# EAGLE design fp_bnc (EAGLE 9.6.2)
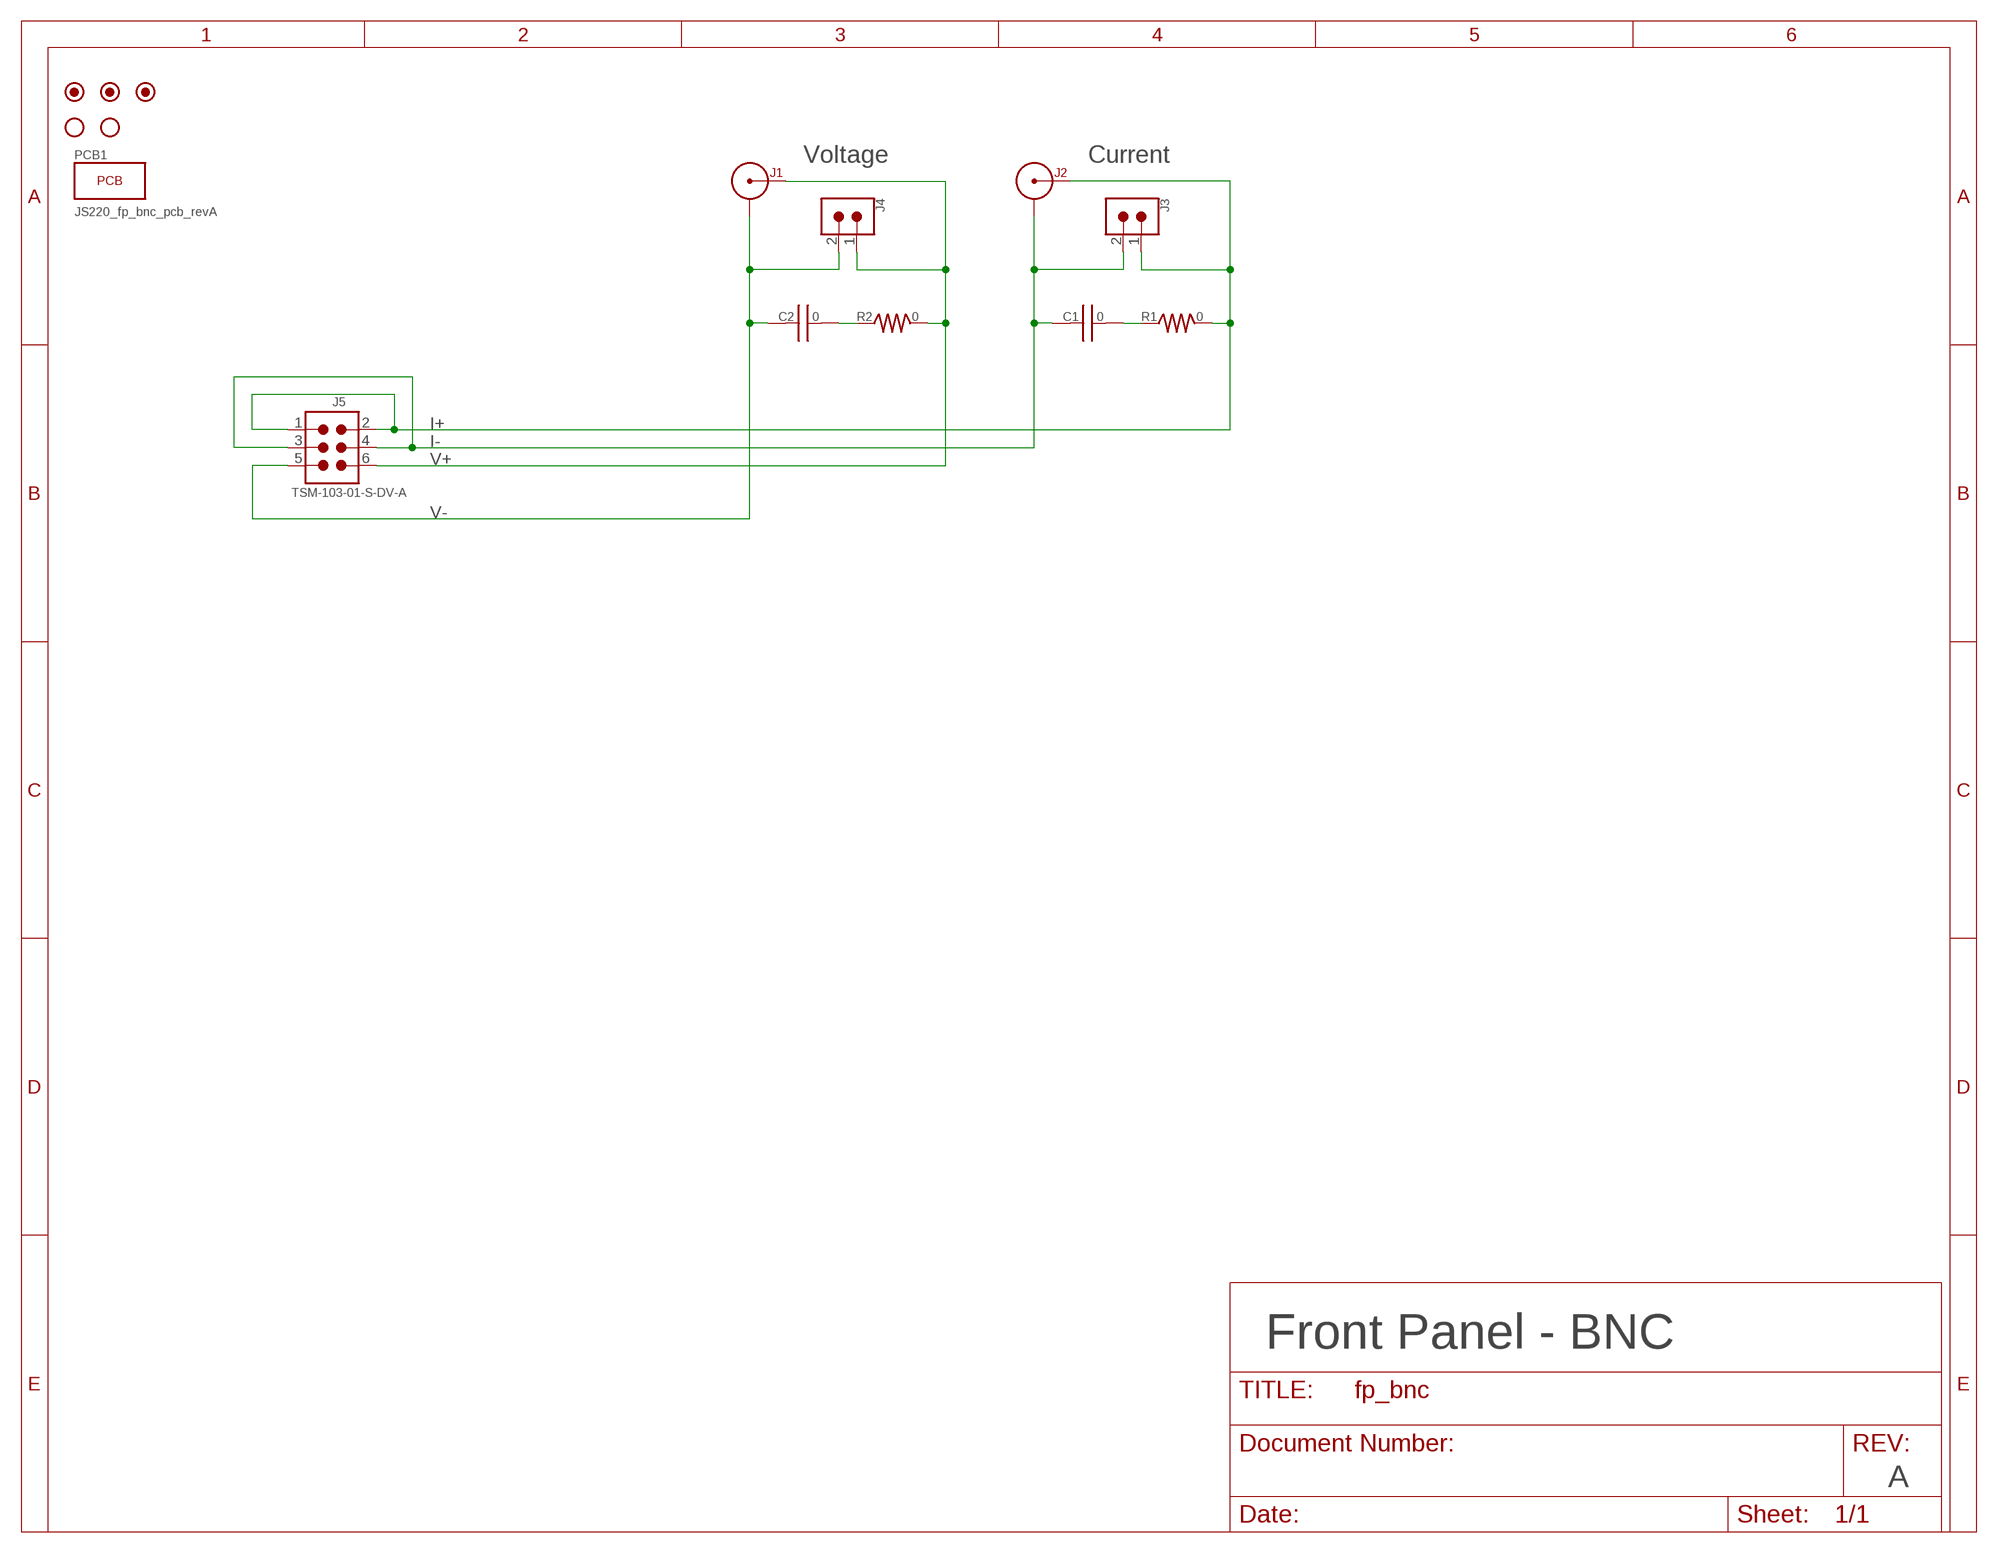
[diagram p0: schematic, sheet 1]
PCB1 (PCB): POPULATE: 1

## Parts
C1  0  CAP_0603  [0603]
C2  0  CAP_0603  [0603]
FUD1  FIDUCIAL_1MM  [FIDUCIAL_1MM_2MM]
FUD2  FIDUCIAL_1MM  [FIDUCIAL_1MM_2MM]
FUD3  FIDUCIAL_1MM  [FIDUCIAL_1MM_2MM]
H1  HOLE_#6_NORESTRICT  [HOLE_3.5MM_NORESTRICT]
H2  HOLE_#6_NORESTRICT  [HOLE_3.5MM_NORESTRICT]
J1  031-5329-52RFX  BNC_JACKBNC_31-5329-52RFX  [BNC_31-5329-52RFX]
J2  031-5329-52RFX  BNC_JACKBNC_31-5329-52RFX  [BNC_31-5329-52RFX]
J3  CONN_0.1_2X1  [CONN_0.1_2X1_M]
J4  CONN_0.1_2X1  [CONN_0.1_2X1_M]
J5  TSM-103-01-S-DV-A  CONN_0.1_3X2_MSA  [CONN_0.1_3X2_MSA]
R1  0  RESISTOR_1206  [1206]
R2  0  RESISTOR_1206  [1206]

## Nets
I+: J2.SIGNAL J3.1 J5.1 J5.2 R1.2
I-: C1.1 J2.G@1(SHIELD) J2.G@2(SHIELD) J2.G@3(SHIELD) J2.G@4(SHIELD) J3.2 J5.3 J5.4
I_T: C1.2 R1.1
V+: J1.SIGNAL J4.1 J5.6 R2.2
V-: C2.1 J1.G@1(SHIELD) J1.G@2(SHIELD) J1.G@3(SHIELD) J1.G@4(SHIELD) J4.2 J5.5
V_T: C2.2 R2.1

## Notes on the sheet
- Voltage | Current
- Front Panel - BNC
- A

## Library data of the parts
C1 C2 = jetperch:CAP; POPULATE: 0
FUD1-FUD3 = jetperch:FIDUCIAL; POPULATE: 0
H1 H2 = jetperch:HOLE; POPULATE: 0
J1 J2 = jetperch:BNC_JACK: BNC Jack (female) 31-5640-1010 is right angle, through hole 31-5329-52RFX is straight, through hole; MPN: 031-5329-52RFX; POPULATE: 1
J3 J4 = jetperch:CONN_0.1_2X1: 2x1 0.1" header; POPULATE: 0
J5 = jetperch:CONN_0.1_3X2; MPN: TSM-103-01-S-DV-A; POPULATE: 1
R1 R2 = jetperch:RESISTOR; POPULATE: 0; TOLERANCE: 1%

## Board
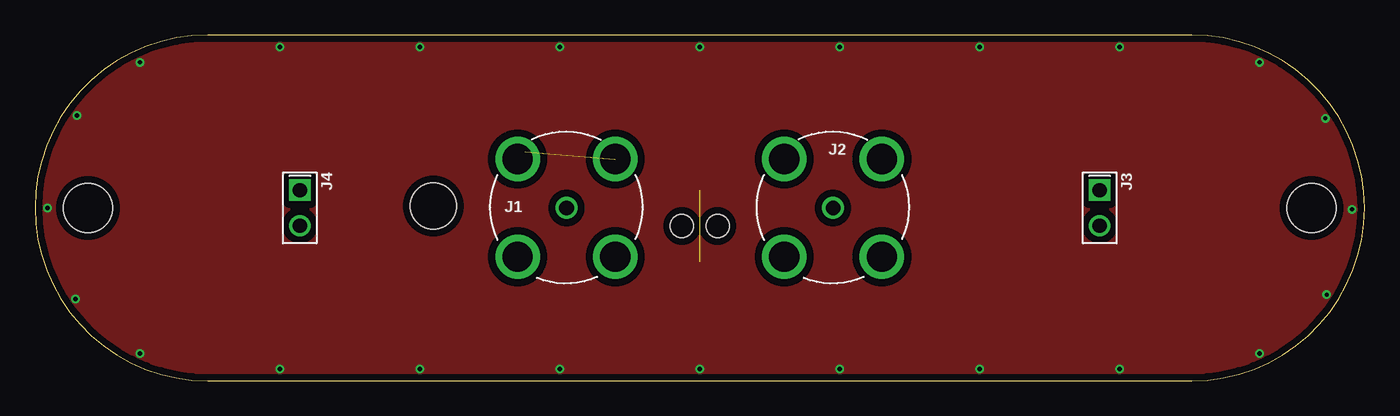
[diagram p1: board, top side]
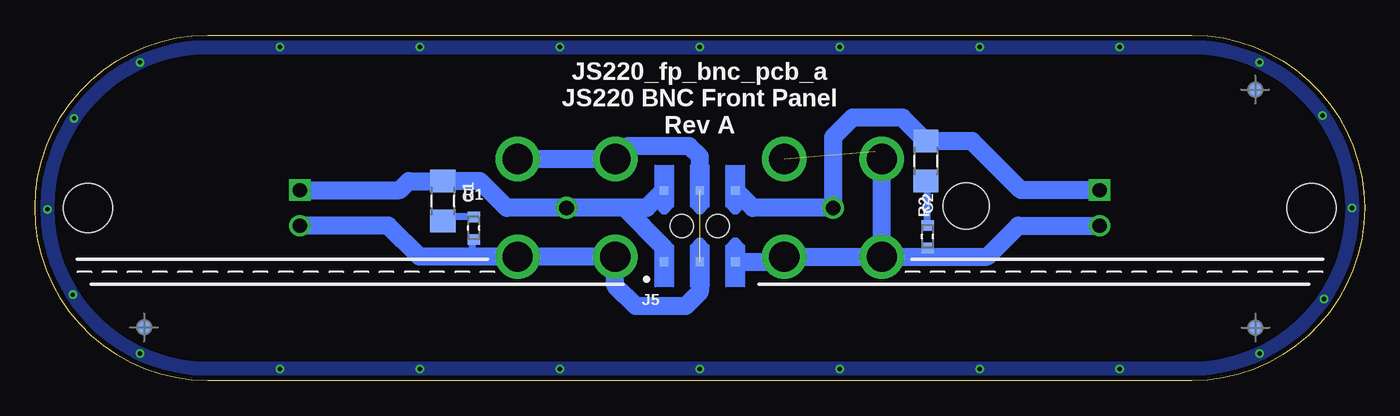
[diagram p2: board, bottom side, seen from below]

Size 95 x 24.7 mm. Coordinates in mm from the lower left corner, seen from the top.
Outline: 0,12.35 arc90 12.35,0 82.65,0 arc90 95,12.35 arc90 82.65,24.7 12.35,24.7 arc90 0,12.35
Copper layers (1*16): Top 0.035mm / dielectric 62mil / Bottom 0.035mm
Design rules "jetperch_2layer_oshpark": minimum track width 6mil, minimum drill 12mil, track to track 6mil, track to pad 6mil, pad to pad 6mil, via to via 6mil, smd to smd 0mil, copper to edge 15mil, drill to drill 15mil, minimum pad ring 6mil, minimum via ring 6mil, stop-mask expansion 2mil, vias tented up to drill 15mil, thermal gap 10mil
Holes 3.3 mm at 28.45,12.5

### Footprints (pad centres in the part's own frame; a part is rotated, then mirrored left to right if it is on the bottom)
0603 = smd 0.75 x 0.9: 1 -0.8,0; 2 0.8,0
FIDUCIAL_1MM_2MM = smd 1.016 x 1.016: P1 0,0
HOLE_3.5MM_NORESTRICT = hole 3.5: 0,0
BNC_31-5329-52RFX = drill 2.159: G@1 -3.489,3.489; G@2 3.489,3.489; G@3 3.489,-3.489; G@4 -3.489,-3.489 | drill 1.05: SIGNAL 0,0
CONN_0.1_2X1_M = drill 1.016 square: 1 -1.27,0 | drill 1.016: 2 1.27,0
CONN_0.1_3X2_MSA = smd 0.635 x 0.635: 1 -2.54,-2.54; 2 -2.54,2.54; 3 0,-2.54; 4 0,2.54; 5 2.54,-2.54; 6 2.54,2.54 | hole 1.651: -1.27,0; 1.27,0
1206 = smd 1.6 x 1.803: 1 -1.422,0; 2 1.422,0

### Placement (x,y rotation side)
C1  63.66,10.91 90 bottom
C2  31.22,10.3 90 bottom
FUD1  7.79,3.79 0 bottom
FUD2  7.81,20.79 0 bottom
FUD3  87.21,3.81 0 bottom
H1  3.79,12.35 0 top
H2  91.21,12.35 0 top
J1  37.98,12.35 0 top
J2  57.02,12.35 0 top
J3  76.08,12.35 270 top
J4  18.93,12.35 270 top
J5  47.5,11.06 0 bottom
R1  65.86,12.84 90 bottom
R2  31.34,15.7 90 bottom

### Tracks (layer width: path | path; a pad name or v marks a point on that pad's centre or on a via)
CGND  (via drill 0.3)
  other vias: 47.5,23.85 57.5,23.85 67.5,23.85 77.5,23.85 37.5,23.85 27.5,23.85 17.5,23.85 17.5,0.85 27.5,0.85 37.5,0.85 47.5,0.85 57.5,0.85 67.5,0.85 77.5,0.85 87.5,22.75 87.5,1.95 94.1,12.25 92.2,18.75 92.3,6.15 7.5,1.95 7.5,22.75 3,18.95 0.9,12.35 2.9,5.85
  pour Top (isolate 0.508): 12.35,24.7 82.65,24.7 arc-90 95,12.35 arc-90 82.65,0 12.35,0 arc-90 0,12.35 arc-90
  pour Bottom (isolate 0.254): 48,0 12.35,0 arc-90 0,12.35 arc-90 12.35,24.7 47.5,24.7 47.5,23.45 12.35,23.45 arc90 1.25,12.35 arc90 12.35,1.25 47.5,1.25
  pour Bottom (isolate 0.254): 47.5,0 47.5,1.25 82.65,1.25 arc90 93.75,12.35 arc90 82.65,23.45 47.5,23.45 47.5,24.7 82.65,24.7 arc-90 95,12.35 arc-90 82.65,0
I+
  Bottom 1.27: J5.1 50.04,9.5 52.89,12.35 | 52.89,12.35 J2.SIGNAL 61.3,12.35 63.21,14.26 R1.2 68.29,14.26 68.93,13.62 J3.1 | J5.2 51.29,12.35 52.89,12.35
I-  (1 unrouted)
  Bottom 0.508: 60.77,16.1 J2.G@2 | C1.1 63.75,10.01 63.75,8.86
  Bottom 1.27: J5.3 47.5,6.35 48.51,5.33 52.07,5.33 53.54,6.8 J2.G@4 J2.G@3 63.75,8.86 67.53,8.86 69.75,11.08 J3.2 | J5.4 47.5,16 48.26,16.76 52.61,16.76 J2.G@1 J2.G@2
I_T
  Bottom 0.508: C1.2 65.57,11.71 R1.1
V+
  Bottom 1.27: J5.6 43.71,12.35 J1.SIGNAL 37.98,17.4 36.58,18.8 33.02,18.8 R2.2 28.04,17.12 24.54,13.62 J4.1
V-  (1 unrouted)
  Bottom 0.508: 35,16.35 J1.G@1 | C2.1 31.24,9.48 31.24,8.86
  Bottom 1.27: J5.5 41.81,8.52 J1.G@3 J1.G@4 | J1.G@4 J1.G@1 | J1.G@4 31.24,8.86 26.95,8.86 24.73,11.08 J4.2
V_T
  Bottom 0.508: C2.2 31.22,14.16 R2.1

### Text on the board
bNames: JS220_fp_bnc_pcb_a / JS220 BNC Front Panel / Rev A
tStop: Voltage | Current | Sensor / Status | ±15V | ±3A | , ±10A pulse | Isolated / ±48V max to USB ground
Measures: Sensor Status | 2x holes
FabDoc1: All dimensions in millimeters | Place all markings on back (including pcb order number). / Add flammability rating marking on back, such as 94V-0. / The front-side surface is cosmetic - reject units with scratches and blemishes.